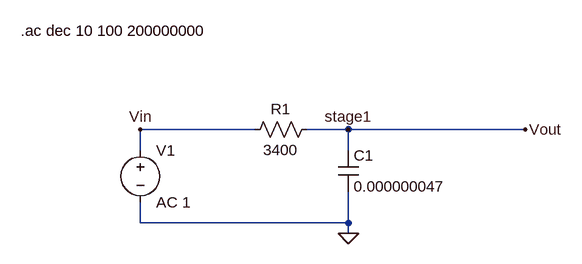
[diagram p0: schematic rc_filter.asc]
rc_filter.asc, the LTspice schematic file:
Version 4.1
SHEET 1 880 680
WIRE 256 96 80 96
WIRE 400 96 336 96
WIRE 672 96 400 96
WIRE 80 128 80 96
WIRE 400 128 400 96
WIRE 80 240 80 208
WIRE 400 240 400 192
WIRE 400 240 80 240
WIRE 400 256 400 240
FLAG 400 256 0
FLAG 80 96 Vin
FLAG 672 96 Vout
FLAG 400 96 stage1
SYMBOL res 352 80 R90
WINDOW 0 0 56 VBottom 2
WINDOW 3 32 56 VTop 2
SYMATTR InstName R1
SYMATTR Value 3400
SYMBOL cap 384 128 R0
SYMATTR InstName C1
SYMATTR Value 0.000000047
SYMBOL voltage 80 112 R0
SYMATTR InstName V1
SYMATTR Value AC 1
TEXT -104 -56 Left 2 !.ac dec 10 100 200000000

The netlist it stands for:
* rc_filter.asc
R1 stage1 Vin 3400
C1 stage1 0 0.000000047
V1 Vin 0 AC 1
.ac dec 10 100 200000000
.backanno
.end

* Results of the author's LTspice run, read from the files saved beside the schematic
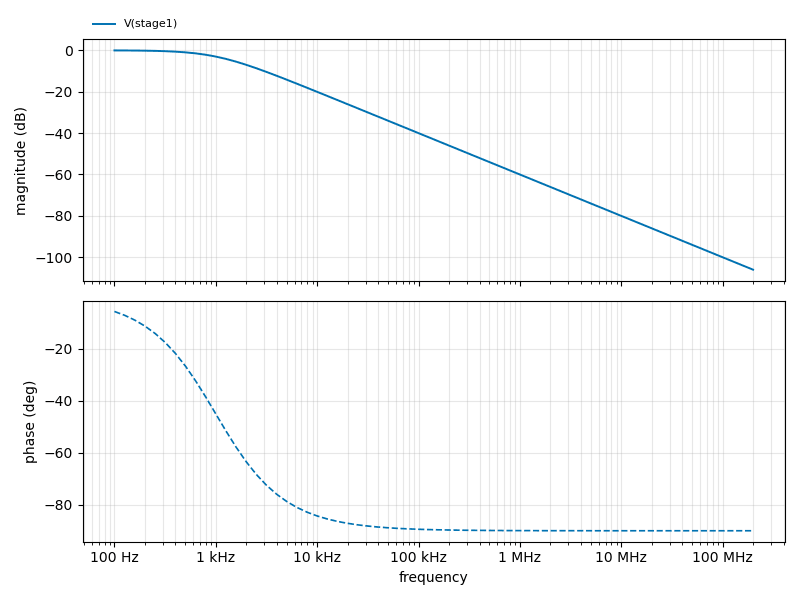
[diagram p1: AC Analysis of rc_filter.asc, plotted from the saved traces]
* AC Analysis, 1 run:
*   V(stage1): -0.04 dB at 100 Hz, -106.06 dB at 200 MHz, peak -0.04 dB at 100 Hz, 3 dB below the peak at 1.005 kHz